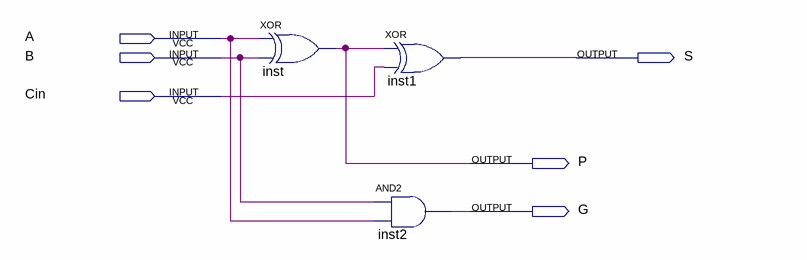
[diagram p0: schematic sheet]
// Quartus schematic FAM.bdf as structural Verilog: 3 symbols, 6 pins
module FAM (
  input  A,
  input  B,
  input  Cin,
  output S,
  output P,
  output G
);

  xor inst (P, A, B);
  xor inst1 (S, P, Cin);
  and inst2 (G, B, A);
endmodule
